# Altium schematic sheet MedioPuente.SchDoc
size A4; SheetNumber: 3; SheetTotal: 4
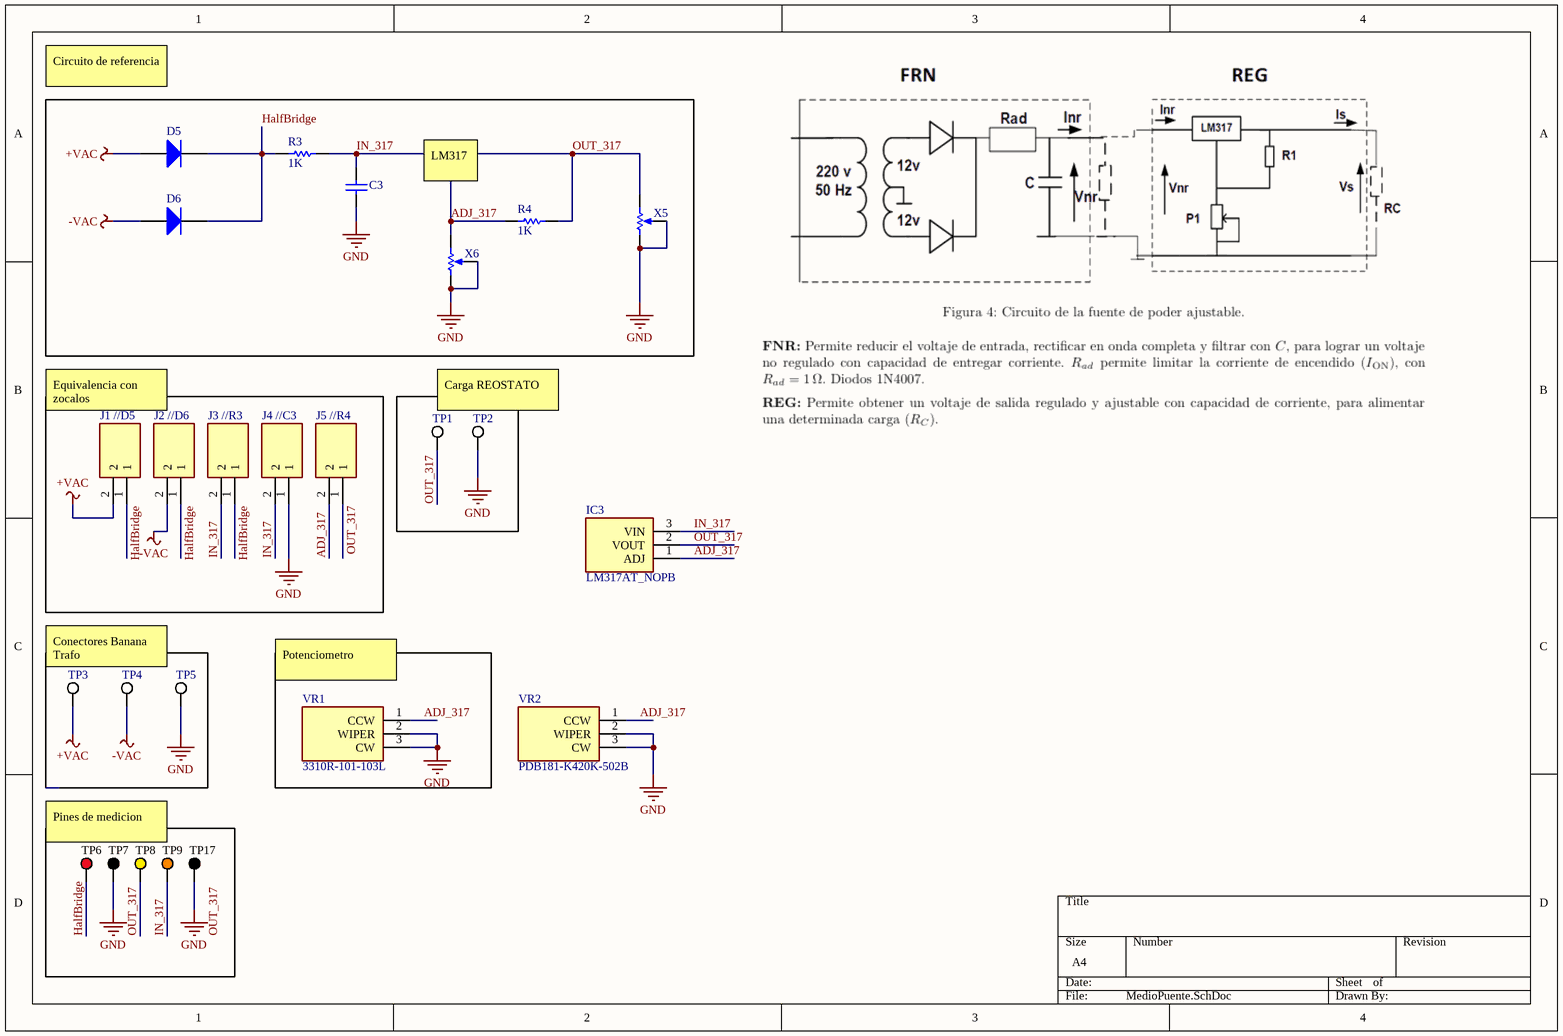
[diagram p0: MedioPuente.SchDoc]

## Parts
C3  Capacitor  (value not drawn)
D5  Diode  (value not drawn)
D6  Diode  (value not drawn)
IC3  LM317AT_NOPB  [TO254P470X1028X1955-3P]
J1  D01-9970242  [D019970242]  (value not drawn)
J2  D01-9970242  [D019970242]  (value not drawn)
J3  D01-9970242  [D019970242]  (value not drawn)
J4  D01-9970242  [D019970242]  (value not drawn)
J5  D01-9970242  [D019970242]  (value not drawn)
R3  value 1K  (hidden comment: Resistor)
R4  value 1K  (hidden comment: Resistor)
TP1  575-4  [KSTN-575-4]  (value not drawn)
TP2  575-4  [KSTN-575-4]  (value not drawn)
TP3  575-4  [KSTN-575-4]  (value not drawn)
TP4  575-4  [KSTN-575-4]  (value not drawn)
TP5  575-4  [KSTN-575-4]  (value not drawn)
TP6  5010  [KSTN-5010_V]  (value not drawn)
TP7  5011  [KSTN-5011_V]  (value not drawn)
TP8  5014  [KSTN-5014_V]  (value not drawn)
TP9  5013  [KSTN-5013_V]  (value not drawn)
TP17  5011  [KSTN-5011_V]  (value not drawn)
VR1  3310R-101-103L  [3310R125103L]
VR2  PDB181-K420K-502B  [PDB181K220K104B]
X5  Potentiometer  (value not drawn)
X6  Potentiometer  (value not drawn)

## Nets
+VAC: D5.1(A) J1.2 TP3.1
-VAC: D6.1(A) J2.2 TP4.1
GND: C3.1 J4.1 TP2.1 TP5.1 TP7.1 TP17.1 VR1.2(WIPER) VR1.3(CW) VR2.2(WIPER) VR2.3(CW) X5.1(TOP) X5.3(TAP) X6.1(TOP) X6.3(TAP)
ADJ_317: IC3.1(ADJ) J5.2 R4.1 VR1.1(CCW) VR2.1(CCW) X6.2(BOT)
HalfBridge: D5.2(K) D6.2(K) J1.1 J2.1 J3.1 R3.1 TP6.1
IN_317: C3.2 IC3.3(VIN) J3.2 J4.2 R3.2 TP9.1
OUT_317: IC3.2(VOUT) J5.1 R4.2 TP1.1 TP8.1 X5.2(BOT)

## Notes on the sheet
- Circuito de referencia
- LM317
- Equivalencia con zocalos
- //D5
- //D6
- //R3
- //C3
- //R4
- Carga REOSTATO
- Conectores Banana Trafo
- (near VR1) Potenciometro
- Pines de medicion
- Labels drawn without touching a wire or pin: OUT_317

## Library data of the parts
C3 = Capacitor: SimulationGenericComponent: True; Value: 1p
D5 D6 = Diode: AF: 1; BV: 0; BV_MAX: 1e99; EG: 1.11; FC: 0.5; IBV: 0.001; ISR: 1e-14; MJSW: 0.33; NTUN: 30; TNOM: 27; XTI: 3; SimulationGenericComponent: True; CJO: 0; CJP: 0; CTA: 0; CTP: 0; FCS: 0.5; FV_MAX: 1e99; IKF: 0; IKR: 0; JSW: 0; JTUN: 0; JTUNSW: 0; KEG: 1; KF: 0; LEVEL: 1; N: 1; NBV: 1; NR: 1; NS: 1; PHP: 1; RS: 0; TCV: 0; TLEV: 0; TLEVC: 0; TM1: 0; TM2: 0; TPB: 0; TPHP: 0; TRS: 0; TRS2: 0; TT: 0; TTT1: 0; TTT2: 0; VJ: 1; XTITUN: 3; IS: 1e-14
IC3 = LM317AT_NOPB: Integrated Circuit; Manufacturer_Name: Texas Instruments; Manufacturer_Part_Number: LM317AT/NOPB; Datasheet Link: http://www.ti.com/lit/gpn/lm317a; Height: 4.7mm; Mouser Part Number: 926-LM317AT/NOPB; Mouser Price/Stock: https://www.mouser.co.uk/ProductDetail/Texas-Instruments/LM317AT-NOPB?qs=X1J7HmVL2ZFYFJRcNgsWcQ%3D%3D; Arrow Part Number: LM317AT/NOPB; Arrow Price/Stock: https://www.arrow.com/en/products/lm317atnopb/texas-instruments?utm_currency=USD&region=europe
J1-J5 = D01-9970242: IC Socket: 2 Pos Receptacle SIL Straight THT Strip; Manufacturer_Name: Harwin; Geometry.Height: 4.2mm; Mouser Part Number: 855-D01-9970242; Mouser Price/Stock: https://www.mouser.co.uk/ProductDetail/Harwin/D01-9970242?qs=TpUtqFO9vU%252Bf37OJ5TYoTQ%3D%3D; Manufacturer_Part_Number: D01-9970242; Datasheet Link: https://content.harwin.com/m/e0b6c35948424a73/original/DRG-00097-Technical-Drawing-Datasheet-D01-997-pdf.pdf
R3 R4 = Resistor: TC1: 0; SimulationGenericComponent: True; TC2: 0
TP1-TP5 = CMP-2000-05649-1: Banana Jack, Non-Insulated, 1-Pin THD, RoHS, Bulk; Manufacturer: Keystone-Electronics; Package Version: Rev. B, 11/1994; Plug/Mating Plug Diameter: StandardBanana; Gender: Female; Package Reference: 575-4; Operating Temperature: -; Contact Material: Brass; Packaging: Bulk; Series: -; Category: Connectors,Interconnects; Color: -; Type: BananaJack; Contact Finish: Nickel; Features: -; Family: BananaandTipConnectors-Jacks,Plugs; Body Material: -; Manufacturer URL: http://www.keyelco.com/; Termination: Solder; Insulation: Non-Insulated; Datasheet Version: Rev. B, 11/1994; Mounting Technology: ThroughHole; Package URL: http://www.keyelco.com/product-pdf.cfm?p=2379; Mounting Type: ThroughHole; Package Description: 1-Pin Through Hole Device, Dia 7.92 mm; Datasheet URL: http://www.keyelco.com/product-pdf.cfm?p=2379; Wire Gauge: -
TP6 = CMP-1672-00002-4: Test Point, Red, Through Hole, RoHS, Bulk; Manufacturer: Keystone; Contact Material: Bronze; Mounting Technology: Through Hole; RoHSCompliant: true; Pins: 1; Package Quantity: 100; ComponentLink2Description: Datasheet; Height: 8.12 mm; ComponentLink1URL: http://www.keyelco.com/; DatasheetVersion: Rev. F, 12/2013; Mount: Through Hole; PackageReference: 5010; Contact Plating: Silver; Packaging: Bulk; Colour: Red; REACH SVHC: No SVHC; PackageDescription: 1-Pin Through Hole Device, Dia 3.17 mm; ComponentLink2URL: http://www.keyelco.com/product-pdf.cfm?p=1319; ComponentLink1Description: Manufacturer URL
TP7 TP17 = CMP-1672-00003-4: Test Point, Black, Through Hole, RoHS, Bulk; Manufacturer: Keystone; ComponentLink2URL: http://www.keyelco.com/product-pdf.cfm?p=1320; Colour: Black; Pins: 1; REACH SVHC: No SVHC; ComponentLink1URL: http://www.keyelco.com/; PackageReference: 5011; Contact Plating: Silver; Package Quantity: 100; Packaging: Bulk; RoHSCompliant: true; Height: 8.12 mm; PackageDescription: 1-Pin Through Hole Device, Dia 3.17 mm; Mount: Through Hole; Mounting Technology: Through Hole; DatasheetVersion: Rev. F, 12/2013; ComponentLink1Description: Manufacturer URL; Contact Material: Bronze; ComponentLink2Description: Datasheet
TP8 = CMP-1672-00006-4: Test Point, Yellow, Through Hole, RoHS, Bulk; Manufacturer: Keystone; PackageDescription: 1-Pin Through Hole Device, Dia 3.17 mm; REACH SVHC: No SVHC; ComponentLink2Description: Datasheet; ComponentLink2URL: http://www.keyelco.com/product-pdf.cfm?p=1323; Package Quantity: 100; Colour: Yellow; Height: 8.12 mm; RoHSCompliant: true; Contact Material: Bronze; Mount: Through Hole; Contact Plating: Silver; ComponentLink1URL: http://www.keyelco.com/; Packaging: Bulk; Mounting Technology: Through Hole; PackageReference: 5014; ComponentLink1Description: Manufacturer URL; DatasheetVersion: Rev. F, 12/2013
TP9 = CMP-1672-00005-4: Test Point, Orange, Through Hole, RoHS, Bulk; Manufacturer: Keystone; REACH SVHC: No SVHC; ComponentLink2Description: Datasheet; PackageDescription: 1-Pin Through Hole Device, Dia 3.17 mm; Package Quantity: 100; PackageReference: 5013; Contact Material: Bronze; DatasheetVersion: Rev. F, 12/2013; ComponentLink2URL: http://www.keyelco.com/product-pdf.cfm?p=1322; Contact Plating: Silver; ComponentLink1URL: http://www.keyelco.com/; Packaging: Bulk; ComponentLink1Description: Manufacturer URL; Colour: Orange; Height: 8.12 mm; RoHSCompliant: True; Mount: Through Hole; Mounting Technology: Through Hole
VR1 = 3310R-101-103L: Variable Resistor; Manufacturer_Name: Bourns; Datasheet Link: https://www.mouser.com/datasheet/2/54/3310-776730.pdf; Height: 17mm; Manufacturer_Part_Number: 3310R-101-103L; Mouser Part Number: 652-3310R-101-103L; Mouser Price/Stock: https://www.mouser.co.uk/ProductDetail/Bourns/3310R-101-103L?qs=eLugBjTgzvN7VrCch33oXQ%3D%3D
VR2 = PDB181-K420K-502B: Variable Resistor; Manufacturer_Name: Bourns; Datasheet Link: https://www.bourns.com/docs/product-datasheets/PDB18.pdf; Height: 16.5mm; Manufacturer_Part_Number: PDB181-K420K-502B; Mouser Part Number: 652-PDB181-K420K502B; Mouser Price/Stock: https://www.mouser.co.uk/ProductDetail/Bourns/PDB181-K420K-502B?qs=Ivs1Be2ZGq6EMYRq4LQhiA%3D%3D; Arrow Part Number: PDB181-K420K-502B; Arrow Price/Stock: https://www.arrow.com/en/products/pdb181-k420k-502b/bourns?region=nac
X5 X6 = Potentiometer: value: 1k; position: 0.5; SimulationGenericComponent: True